# Altium project Nestling_2.1_ExpensionBoard.PrjPCB
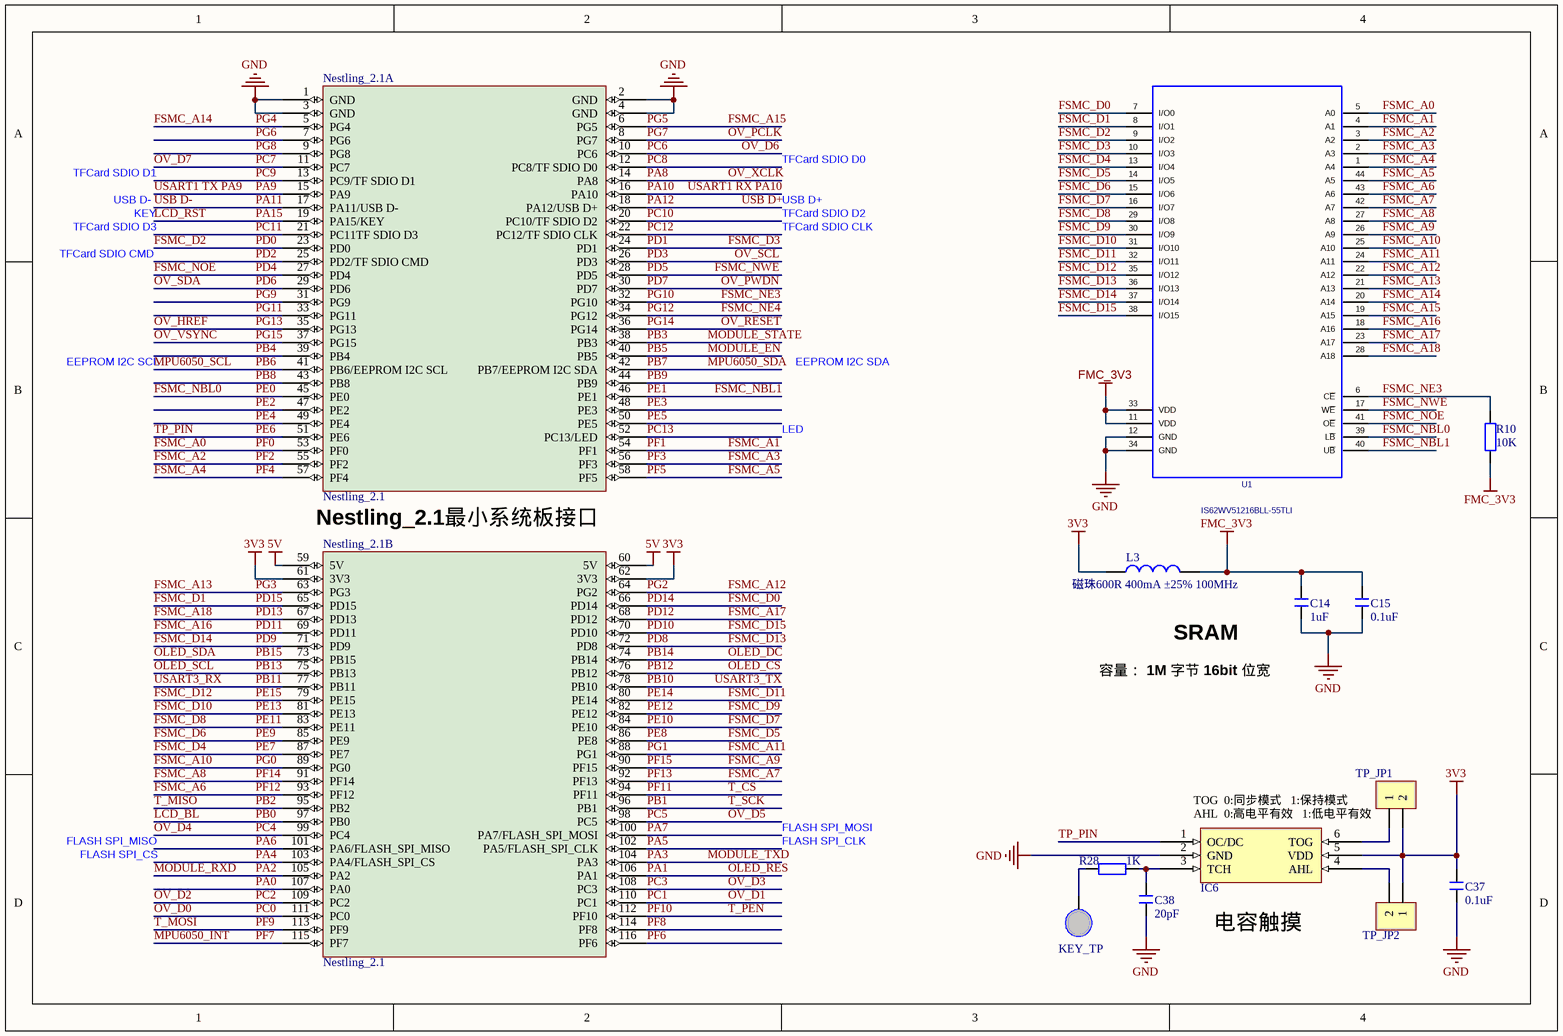
[diagram p0: Nestling_2.1_EXB.SchDoc]
7 sheets, 103 parts. Net scope: global (net labels, ports and power ports of the same name join across sheets).
Board file: Nestling_2.x_EXB.PcbDoc
Sheets:
  Nestling_2.1_EXB.SchDoc
  Nestling_2.1_EXB_POWER.SchDoc
  Nestling_2.1_EXB_Interface.SchDoc
  Nestling_2.1_EXB_MPU6050.SchDoc
  Nestling_2.1_EXB_OLED.SchDoc
  Nestling_2.1_EXB_WIFI_ESP8266EX.SchDoc
  Nestling_2.1_EXB_IO.SchDoc

## Sheet Nestling_2.1_EXB.SchDoc
size A4

### Parts
C14  1uF  [C 0603_M]
C15  0.1uF  [C 0603_M]
C37  0.1uF  [C 0603_M]
C38  20pF  [C 0603_M]
IC6  RH6015C SOT23-6  [SOT23-6N]  (value not drawn)
KEY_TP  TP_Pin  [TP_PIN_10*13mm]  (value not drawn)
L3  磁珠600R 400mA ±25% 100MHz  [L 0603]
Nestling_2.1  Nestling_2.1  [Nestling_2.1]  (parts A,B of 2)
R10  10K  [R 0603_M]
R28  1K  [R 0603_M]
TP_JP1  HDR-1X2  [HDR2.54-LI-2P]  (value not drawn)
TP_JP2  HDR-1X2  [HDR2.54-LI-2P]  (value not drawn)
U1  IS62WV51216BLL-55TLI  [TSOP44-0.8MM]

### Nets
3V3: C37.2 IC6.5(VDD) L3.1 Nestling_2.1.61(3V3) Nestling_2.1.62(3V3) TP_JP1.2 TP_JP2.1
5V: Nestling_2.1.59(5V) Nestling_2.1.60(5V)
FMC_3V3: C14.2 C15.2 L3.2 R10.2 U1.11(VDD) U1.33(VDD)
GND: C14.1 C15.1 C37.1 C38.1 IC6.2(GND) Nestling_2.1.1(GND) Nestling_2.1.2(GND) Nestling_2.1.3(GND) Nestling_2.1.4(GND) U1.12(GND) U1.34(GND)
FSMC_A0: Nestling_2.1.53(PF0) U1.5(A0)  [also labelled PF0]
FSMC_A1: Nestling_2.1.54(PF1) U1.4(A1)  [also labelled PF1]
FSMC_A2: Nestling_2.1.55(PF2) U1.3(A2)  [also labelled PF2]
FSMC_A3: Nestling_2.1.56(PF3) U1.2(A3)  [also labelled PF3]
FSMC_A4: Nestling_2.1.57(PF4) U1.1(A4)  [also labelled PF4]
FSMC_A5: Nestling_2.1.58(PF5) U1.44(A5)  [also labelled PF5]
FSMC_A6: Nestling_2.1.93(PF12) U1.43(A6)  [also labelled PF12]
FSMC_A7: Nestling_2.1.92(PF13) U1.42(A7)  [also labelled PF13]
FSMC_A8: Nestling_2.1.91(PF14) U1.27(A8)  [also labelled PF14]
FSMC_A9: Nestling_2.1.90(PF15) U1.26(A9)  [also labelled PF15]
FSMC_A10: Nestling_2.1.89(PG0) U1.25(A10)  [also labelled PG0]
FSMC_A11: Nestling_2.1.88(PG1) U1.24(A11)  [also labelled PG1]
FSMC_A12: Nestling_2.1.64(PG2) U1.22(A12)  [also labelled PG2]
FSMC_A13: Nestling_2.1.63(PG3) U1.21(A13)  [also labelled PG3]
FSMC_A14: Nestling_2.1.5(PG4) U1.20(A14)  [also labelled PG4]
FSMC_A15: Nestling_2.1.6(PG5) U1.19(A15)  [also labelled PG5]
FSMC_A16: Nestling_2.1.69(PD11) U1.18(A16)  [also labelled PD11]
FSMC_A17: Nestling_2.1.68(PD12) U1.23(A17)  [also labelled PD12]
FSMC_A18: Nestling_2.1.67(PD13) U1.28(A18)  [also labelled PD13]
FSMC_D0: Nestling_2.1.66(PD14) U1.7(I/O0)  [also labelled PD14]
FSMC_D1: Nestling_2.1.65(PD15) U1.8(I/O1)  [also labelled PD15]
FSMC_D2: Nestling_2.1.23(PD0) U1.9(I/O2)  [also labelled PD0]
FSMC_D3: Nestling_2.1.24(PD1) U1.10(I/O3)  [also labelled PD1]
FSMC_D4: Nestling_2.1.87(PE7) U1.13(I/O4)  [also labelled PE7]
FSMC_D5: Nestling_2.1.86(PE8) U1.14(I/O5)  [also labelled PE8]
FSMC_D6: Nestling_2.1.85(PE9) U1.15(I/O6)  [also labelled PE9]
FSMC_D7: Nestling_2.1.84(PE10) U1.16(I/O7)  [also labelled PE10]
FSMC_D8: Nestling_2.1.83(PE11) U1.29(I/O8)  [also labelled PE11]
FSMC_D9: Nestling_2.1.82(PE12) U1.30(I/O9)  [also labelled PE12]
FSMC_D10: Nestling_2.1.81(PE13) U1.31(I/O10)  [also labelled PE13]
FSMC_D11: Nestling_2.1.80(PE14) U1.32(I/O11)  [also labelled PE14]
FSMC_D12: Nestling_2.1.79(PE15) U1.35(I/O12)  [also labelled PE15]
FSMC_D13: Nestling_2.1.72(PD8) U1.36(I/O13)  [also labelled PD8]
FSMC_D14: Nestling_2.1.71(PD9) U1.37(I/O14)  [also labelled PD9]
FSMC_D15: Nestling_2.1.70(PD10) U1.38(I/O15)  [also labelled PD10]
FSMC_NBL0: Nestling_2.1.45(PE0) U1.39(L~{B})  [also labelled PE0]
FSMC_NBL1: Nestling_2.1.46(PE1) U1.40(U~{B})  [also labelled PE1]
FSMC_NE3: Nestling_2.1.32(PG10) R10.1 U1.6(C~{E})  [also labelled PG10]
FSMC_NE4: Nestling_2.1.34(PG12)  [also labelled PG12]
FSMC_NOE: Nestling_2.1.27(PD4) U1.41(O~{E})  [also labelled PD4]
FSMC_NWE: Nestling_2.1.28(PD5) U1.17(W~{E})  [also labelled PD5]
LCD_BL: Nestling_2.1.97(PB0)  [also labelled PB0]
LCD_RST: Nestling_2.1.19(PA15/KEY)  [also labelled PA15]
MODULE_EN: Nestling_2.1.40(PB5)  [also labelled PB5]
MODULE_RXD: Nestling_2.1.105(PA2)  [also labelled PA2]
MODULE_STATE: Nestling_2.1.38(PB3)  [also labelled PB3]
MODULE_TXD: Nestling_2.1.104(PA3)  [also labelled PA3]
MPU6050_INT: Nestling_2.1.115(PF7)  [also labelled PF7]
MPU6050_SCL: Nestling_2.1.41(PB6/EEPROM_I2C_SCL)  [also labelled PB6]
MPU6050_SDA: Nestling_2.1.42(PB7/EEPROM_I2C_SDA)  [also labelled PB7]
OLED_CS: Nestling_2.1.76(PB12)  [also labelled PB12]
OLED_DC: Nestling_2.1.74(PB14)  [also labelled PB14]
OLED_RES: Nestling_2.1.106(PA1)  [also labelled PA1]
OLED_SCL: Nestling_2.1.75(PB13)  [also labelled PB13]
OLED_SDA: Nestling_2.1.73(PB15)  [also labelled PB15]
OV_D0: Nestling_2.1.111(PC0)  [also labelled PC0]
OV_D1: Nestling_2.1.110(PC1)  [also labelled PC1]
OV_D2: Nestling_2.1.109(PC2)  [also labelled PC2]
OV_D3: Nestling_2.1.108(PC3)  [also labelled PC3]
OV_D4: Nestling_2.1.99(PC4)  [also labelled PC4]
OV_D5: Nestling_2.1.98(PC5)  [also labelled PC5]
OV_D6: Nestling_2.1.10(PC6)  [also labelled PC6]
OV_D7: Nestling_2.1.11(PC7)  [also labelled PC7]
OV_HREF: Nestling_2.1.35(PG13)  [also labelled PG13]
OV_PCLK: Nestling_2.1.8(PG7)  [also labelled PG7]
OV_PWDN: Nestling_2.1.30(PD7)  [also labelled PD7]
OV_RESET: Nestling_2.1.36(PG14)  [also labelled PG14]
OV_SCL: Nestling_2.1.26(PD3)  [also labelled PD3]
OV_SDA: Nestling_2.1.29(PD6)  [also labelled PD6]
OV_VSYNC: Nestling_2.1.37(PG15)  [also labelled PG15]
OV_XCLK: Nestling_2.1.14(PA8)  [also labelled PA8]
PA0: Nestling_2.1.107(PA0)
PA4: Nestling_2.1.103(PA4/FLASH_SPI_CS)
PA5: Nestling_2.1.102(PA5/FLASH_SPI_CLK)
PA6: Nestling_2.1.101(PA6/FLASH_SPI_MISO)
PA7: Nestling_2.1.100(PA7/FLASH_SPI_MOSI)
PA9: Nestling_2.1.15(PA9)  [also labelled USART1 TX PA9]
PA10: Nestling_2.1.16(PA10)  [also labelled USART1 RX PA10]
PA11: Nestling_2.1.17(PA11/USB_D-)  [also labelled USB D-]
PA12: Nestling_2.1.18(PA12/USB_D+)  [also labelled USB D+]
PB1: Nestling_2.1.96(PB1)  [also labelled T_SCK]
PB2: Nestling_2.1.95(PB2)  [also labelled T_MISO]
PB4: Nestling_2.1.39(PB4)
PB8: Nestling_2.1.43(PB8)
PB9: Nestling_2.1.44(PB9)
PB10: Nestling_2.1.78(PB10)  [also labelled USART3_TX]
PB11: Nestling_2.1.77(PB11)  [also labelled USART3_RX]
PC8: Nestling_2.1.12(PC8/TF_SDIO_D0)
PC9: Nestling_2.1.13(PC9/TF_SDIO_D1)
PC10: Nestling_2.1.20(PC10/TF_SDIO_D2)
PC11: Nestling_2.1.21(PC11TF_SDIO_D3)
PC12: Nestling_2.1.22(PC12/TF_SDIO_CLK)
PC13: Nestling_2.1.52(PC13/LED)
PD2: Nestling_2.1.25(PD2/TF_SDIO_CMD)
PE2: Nestling_2.1.47(PE2)
PE3: Nestling_2.1.48(PE3)
PE4: Nestling_2.1.49(PE4)
PE5: Nestling_2.1.50(PE5)
PE6: IC6.1(OC/DC) Nestling_2.1.51(PE6)  [also labelled TP_PIN]
PF6: Nestling_2.1.116(PF6)
PF8: Nestling_2.1.114(PF8)
PF9: Nestling_2.1.113(PF9)  [also labelled T_MOSI]
PF10: Nestling_2.1.112(PF10)  [also labelled T_PEN]
PF11: Nestling_2.1.94(PF11)  [also labelled T_CS]
PG6: Nestling_2.1.7(PG6)
PG8: Nestling_2.1.9(PG8)
PG9: Nestling_2.1.31(PG9)
PG11: Nestling_2.1.33(PG11)
NetC38_2: C38.2 IC6.3(TCH) R28.1
NetIC6_4: IC6.4(AHL) TP_JP2.2
NetIC6_6: IC6.6(TOG) TP_JP1.1
NetKEY_TP_1: KEY_TP.1 R28.2

### Notes on the sheet
- TFCard SDIO D1
- TFCard SDIO D0
- TFCard SDIO D3
- USB D-
- KEY
- TFCard SDIO CLK
- TFCard SDIO D2
- USB D+
- TFCard SDIO CMD
- EEPROM I2C SCL
- EEPROM I2C SDA
- LED
- (near Nestling_2.1) Nestling_2.1最小系统板接口
- (near L3) SRAM
- 容量： 1M 字节 16bit 位宽
- FLASH SPI_MISO
- FLASH SPI_CLK
- FLASH SPI_MOSI
- (near IC6) TOG  0:同步模式   1:保持模式
- (near IC6) AHL  0:高电平有效   1:低电平有效
- FLASH SPI_CS
- 电容触摸

### Library data of the parts
C14 C15 C37 C38 = C: 无极性贴片电容; 版权归属: 源创客; BOM名称: 无极性贴片电容; 学习资源: www.ooocke.com
IC6 = RH6015C: 贴片单通道电容式触摸感应控制开关IC
L3 = L: 小功率贴片电感; 版权归属: 源创客; BOM名称: 小功率贴片电感; 学习资源: www.ooocke.com
R10 R28 = RES: Resistor
TP_JP1 TP_JP2 = Header 2: 2P接插件; 版权归属: 源创客; BOM名称: 2P接插件; 学习资源: www.ooocke.com
U1 = IS62WV51216BLL-55TLI: TSOP-II,2.5V - 3.6V, 512K x 16,55ns; Manufacturer #1 PN: IS62WV51216BLL-55TI; Manufacturer #1: ISSI; Value: IS62WV51216BLL-55TI; Tolerance: 55ns; PCB DECAL: TSOP44-0.8MM

## Sheet Nestling_2.1_EXB_POWER.SchDoc
size A4
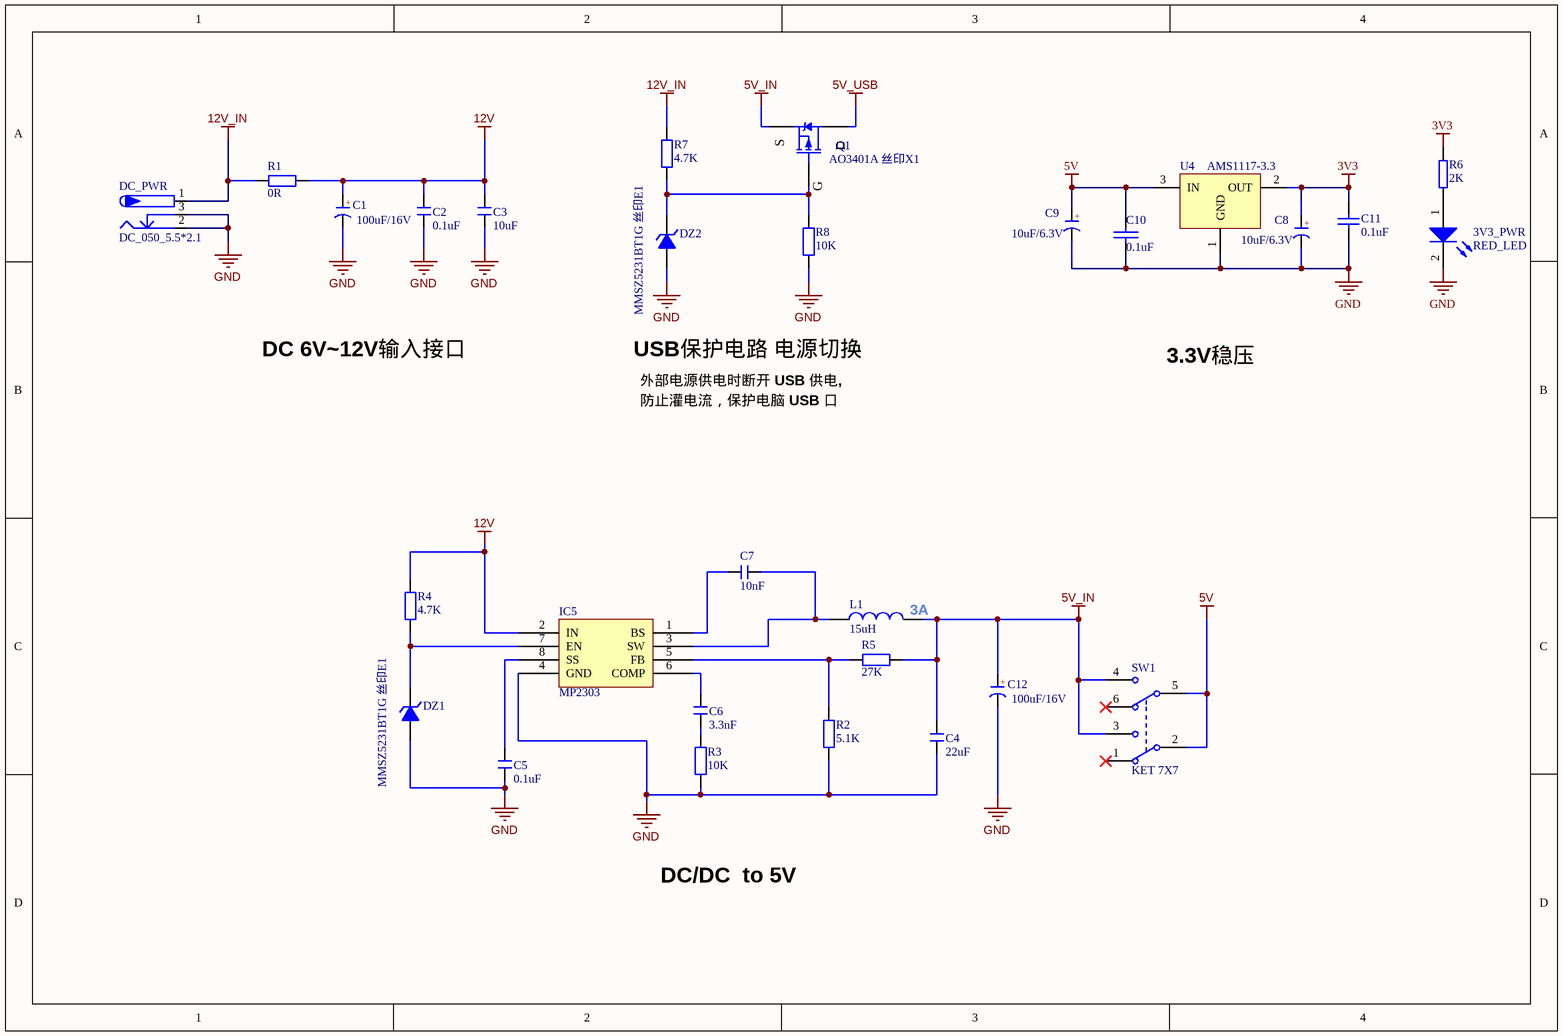
[diagram p1: Nestling_2.1_EXB_POWER.SchDoc]

### Parts
3V3_PWR  RED_LED  [LED 0603R]
C1  100uF/16V  [CM D(6.3*5.4)]
C2  0.1uF  [C 0603_M]
C3  10uF  [C 0603_M]
C4  22uF  [C 0603_M]
C5  0.1uF  [C 0603_M]
C6  3.3nF  [C 0603_M]
C7  10nF  [C 0603_M]
C8  10uF/6.3V  [CD S(2012)]
C9  10uF/6.3V  [CD S(2012)]
C10  0.1uF  [C 0603_M]
C11  0.1uF  [C 0603_M]
C12  100uF/16V  [CM D(6.3*5.4)]
DC_PWR  DC_050_5.5*2.1  [DC-050]
DZ1  MMSZ5231BT1G 丝印E1  [SOD-123]
DZ2  MMSZ5231BT1G 丝印E1  [SOD-123]
IC5  MP2303  [SOP8_N]
L1  15uH  [L-SMD-0630]
Q1  AO3401A 丝印X1  [SOT23-3N]
R1  0R  [R 0603_M]
R2  5.1K  [R 0603_M]
R3  10K  [R 0603_M]
R4  4.7K  [R 0603_M]
R5  27K  [R 0603_M]
R6  2K  [R 0603_M]
R7  4.7K  [R 0603_M]
R8  10K  [R 0603_M]
SW1  KET 7X7  [KFT DIP-7X7]
U4  AMS1117-3.3  [SOT223_N]

### Nets
3V3: C8.1(A) C11.1 R6.2 U4.2(OUT)
5V: C9.1(A) C10.1 SW1.2(COM2) SW1.5(COM2) U4.3(IN)
5V_IN: C4.2 C12.1(A) L1.2 Q1.2(S) R5.1 SW1.3(NO1) SW1.4(NO2)
5V_USB: Q1.3(D)
12V: C1.1(A) C2.2 C3.2 IC5.2(IN) R1.2 R4.2
12V_IN: DC_PWR.1 R1.1 R7.2
GND: 3V3_PWR.2(K) C1.2(K) C2.1 C3.1 C4.1 C5.1 C8.2(K) C9.2(K) C10.2 C11.2 C12.2(K) DC_PWR.2 DC_PWR.3 DZ1.1(A) DZ2.1(A) IC5.4(GND) R2.1 R3.1 R8.1 U4.1(GND)
Net3V3_PWR_1: 3V3_PWR.1(A) R6.1
NetC5_2: C5.2 IC5.8(SS)
NetC6_1: C6.1 R3.2
NetC6_2: C6.2 IC5.6(COMP)
NetC7_1: C7.1 IC5.3(SW) L1.1
NetC7_2: C7.2 IC5.1(BS)
NetDZ1_2: DZ1.2(K) IC5.7(EN) R4.1
NetDZ2_2: DZ2.2(K) Q1.1(G) R7.1 R8.2
NetIC5_5: IC5.5(FB) R2.2 R5.2

Not connected (* = marked no-connect by the designer): SW1 1(NC1)* 6(NC2)*

### Notes on the sheet
- DC 6V~12V输入接口
- USB保护电路 电源切换
- 外部电源供电时断开 USB 供电,
- 3.3V稳压
- 防止灌电流，保护电脑 USB 口
- (near L1) 3A
- DC/DC  to 5V
- (in symbol C-CD) +
- (in symbol C-CM) +

### Library data of the parts
3V3_PWR = LED0: Typical INFRARED GaAs LED
C1 C12 = C-CM: 贴片电解电容; 版权归属: 源创客; BOM名称: 贴片电解电容; 学习资源: www.ooocke.com
C2-C7 = C: 无极性贴片电容; 版权归属: 源创客; BOM名称: 无极性贴片电容; 学习资源: www.ooocke.com
C8 C9 = C-CD: 贴片钽电容; 版权归属: 源创客; BOM名称: 贴片钽电容; 学习资源: www.ooocke.com
C10 = CAP: Capacitor
C11 = Cap: Capacitor; Published: 8-Jun-2000; LatestRevisionDate: 17-Jul-2002; LatestRevisionNote: Re-released for DXP Platform.; PackageReference: RAD-0.3; Publisher: Altium Limited
DC_PWR = P-DC: 低压电源接口; BOM名称: DC电源接口; 版权归属: 源创客; 学习资源: www.ooocke.com
DZ1 DZ2 = 1N4625: 5.1V/0.5W稳压管; 版权归属: 源创客; BOM名称: 5.1V/0.5W稳压管; 学习资源: www.ooocke.com
L1 = L: 小功率贴片电感; 版权归属: 源创客; BOM名称: 小功率贴片电感; 学习资源: www.ooocke.com
Q1 = SI2301: P沟道场效应管; 版权归属: 源创客; BOM名称: P沟道场效应管; 学习资源: www.ooocke.com
R1-R5 R7 R8 = R: 贴片电阻; 版权归属: 源创客; BOM名称: 贴片电阻; 学习资源: www.ooocke.com
R6 = R
SW1 = KET 7X7: 7*7自锁开关; 版权归属: 源创客; BOM名称: 7*7自锁开关; 学习资源: www.ooocke.com
U4 = LT1085CM-3.3

## Sheet Nestling_2.1_EXB_Interface.SchDoc
size A4
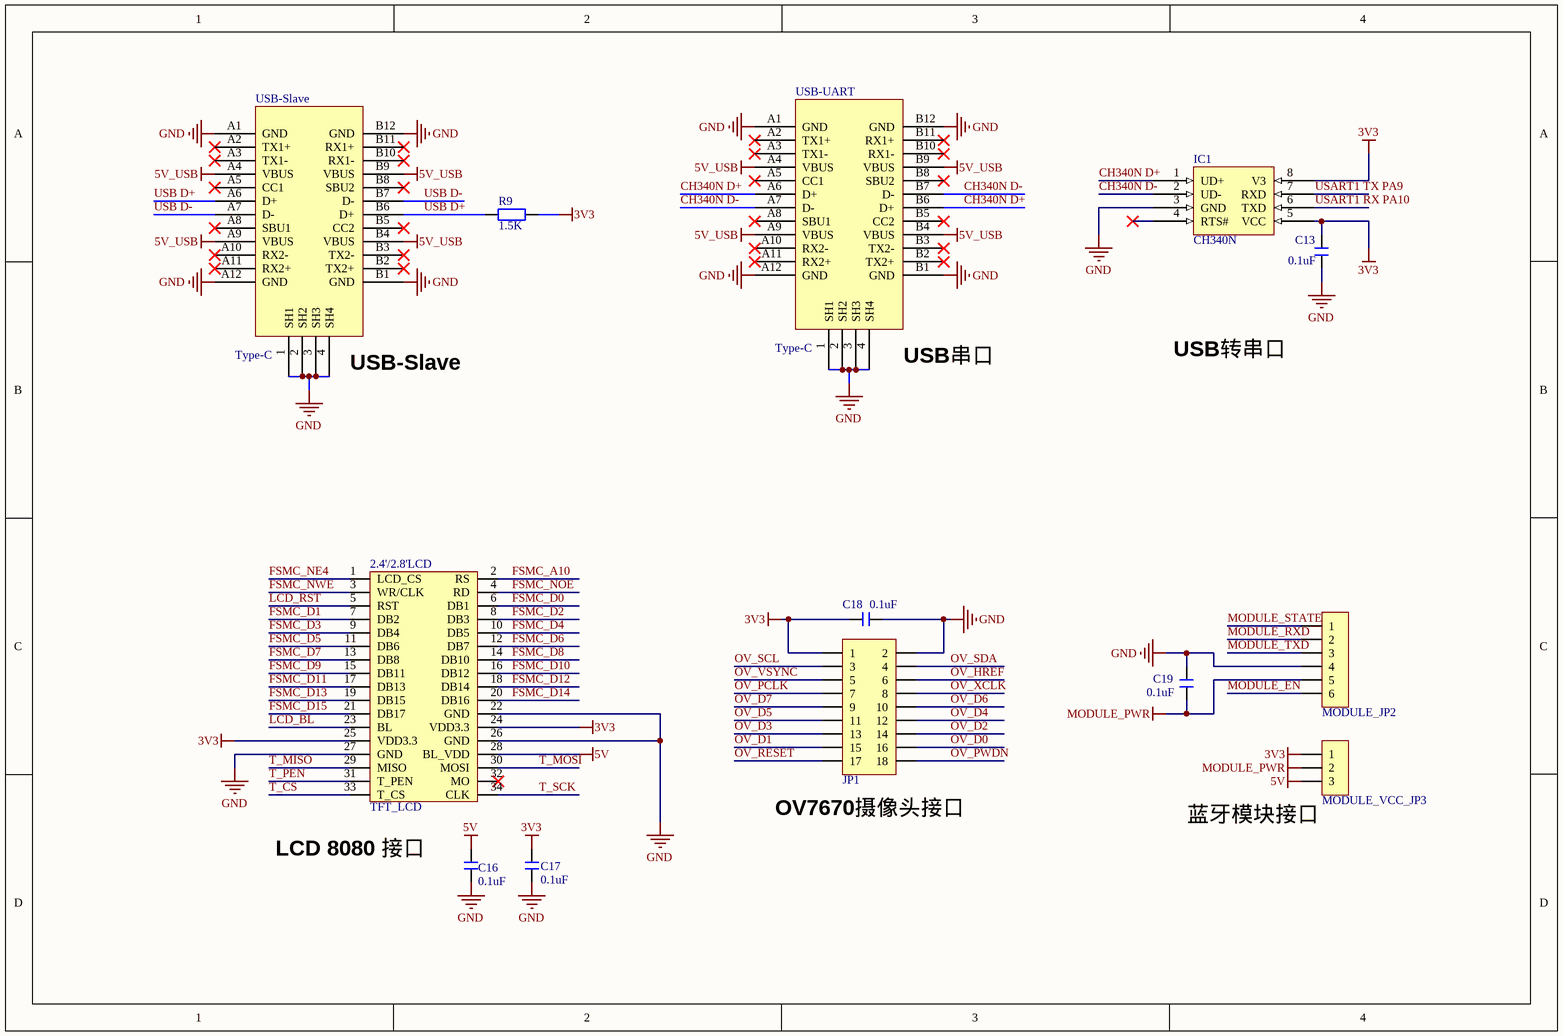
[diagram p2: Nestling_2.1_EXB_Interface.SchDoc]

### Parts
2.4'/2.8'LCD  TFT_LCD  [db2*17-4.3]
C13  0.1uF  [C 0603_M]
C16  0.1uF  [C 0603_M]
C17  0.1uF  [C 0603_M]
C18  0.1uF  [C 0603_M]
C19  0.1uF  [C 0603_M]
IC1  CH340N  [SOP8_N]
JP1  Header 9X2  [HDR2.54-LI-2x9P]  (value not drawn)
MODULE_JP2  HDR-1X6  [HDR2.54-M-LI-6P]  (value not drawn)
MODULE_VCC_JP3  HDR-1X3  [HDR2.54-LI-3P]  (value not drawn)
R9  1.5K  [R 0603_M]
USB-Slave  Type-C  [Type-C]
USB-UART  Type-C  [Type-C]

### Nets
3V3: 2.4'/2.8'LCD.24(VDD3.3) 2.4'/2.8'LCD.25(VDD3.3) C13.2 C17.1 C18.1 IC1.5(VCC) IC1.8(V3) JP1.1 MODULE_VCC_JP3.1 R9.1
5V: 2.4'/2.8'LCD.28(BL_VDD) C16.2 MODULE_VCC_JP3.3
5V_USB: USB-Slave.A4(VBUS) USB-Slave.A9(VBUS) USB-Slave.B4(VBUS) USB-Slave.B9(VBUS) USB-UART.A4(VBUS) USB-UART.A9(VBUS) USB-UART.B4(VBUS) USB-UART.B9(VBUS)
GND: 2.4'/2.8'LCD.22(GND) 2.4'/2.8'LCD.26(GND) 2.4'/2.8'LCD.27(GND) C13.1 C16.1 C17.2 C18.2 C19.2 IC1.3(GND) JP1.2 MODULE_JP2.4 USB-Slave.1(SH1) USB-Slave.2(SH2) USB-Slave.3(SH3) USB-Slave.4(SH4) USB-Slave.A1(GND) USB-Slave.A12(GND) USB-Slave.B1(GND) USB-Slave.B12(GND) USB-UART.1(SH1) USB-UART.2(SH2) USB-UART.3(SH3) USB-UART.4(SH4) USB-UART.A1(GND) USB-UART.A12(GND) USB-UART.B1(GND) USB-UART.B12(GND)
MODULE_PWR: C19.1 MODULE_JP2.5 MODULE_VCC_JP3.2
CH340N D+: IC1.1(UD+) USB-UART.A6(D+) USB-UART.B6(D+)
CH340N D-: IC1.2(UD-) USB-UART.A7(D-) USB-UART.B7(D-)
FSMC_A10: 2.4'/2.8'LCD.2(RS)
FSMC_D0: 2.4'/2.8'LCD.6(DB1)
FSMC_D1: 2.4'/2.8'LCD.7(DB2)
FSMC_D2: 2.4'/2.8'LCD.8(DB3)
FSMC_D3: 2.4'/2.8'LCD.9(DB4)
FSMC_D4: 2.4'/2.8'LCD.10(DB5)
FSMC_D5: 2.4'/2.8'LCD.11(DB6)
FSMC_D6: 2.4'/2.8'LCD.12(DB7)
FSMC_D7: 2.4'/2.8'LCD.13(DB8)
FSMC_D8: 2.4'/2.8'LCD.14(DB10)
FSMC_D9: 2.4'/2.8'LCD.15(DB11)
FSMC_D10: 2.4'/2.8'LCD.16(DB12)
FSMC_D11: 2.4'/2.8'LCD.17(DB13)
FSMC_D12: 2.4'/2.8'LCD.18(DB14)
FSMC_D13: 2.4'/2.8'LCD.19(DB15)
FSMC_D14: 2.4'/2.8'LCD.20(DB16)
FSMC_D15: 2.4'/2.8'LCD.21(DB17)
FSMC_NE4: 2.4'/2.8'LCD.1(LCD_CS)
FSMC_NOE: 2.4'/2.8'LCD.4(RD)
FSMC_NWE: 2.4'/2.8'LCD.3(WR/CLK)
LCD_BL: 2.4'/2.8'LCD.23(BL)
LCD_RST: 2.4'/2.8'LCD.5(RST)
MODULE_EN: MODULE_JP2.6
MODULE_RXD: MODULE_JP2.2
MODULE_STATE: MODULE_JP2.1
MODULE_TXD: MODULE_JP2.3
OV_D0: JP1.16
OV_D1: JP1.15
OV_D2: JP1.14
OV_D3: JP1.13
OV_D4: JP1.12
OV_D5: JP1.11
OV_D6: JP1.10
OV_D7: JP1.9
OV_HREF: JP1.6
OV_PCLK: JP1.7
OV_PWDN: JP1.18
OV_RESET: JP1.17
OV_SCL: JP1.3
OV_SDA: JP1.4
OV_VSYNC: JP1.5
OV_XCLK: JP1.8
T_CS: 2.4'/2.8'LCD.33(T_CS)  [project net PF11]
T_MISO: 2.4'/2.8'LCD.29(MISO)  [project net PB2]
T_MOSI: 2.4'/2.8'LCD.30(MOSI)  [project net PF9]
T_PEN: 2.4'/2.8'LCD.31(T_PEN)  [project net PF10]
T_SCK: 2.4'/2.8'LCD.34(CLK)  [project net PB1]
USART1 RX PA10: IC1.6(TXD)  [project net PA10]
USART1 TX PA9: IC1.7(RXD)  [project net PA9]
USB D+: R9.2 USB-Slave.A6(D+) USB-Slave.B6(D+)  [project net PA12]
USB D-: USB-Slave.A7(D-) USB-Slave.B7(D-)  [project net PA11]

Not connected (* = marked no-connect by the designer): 2.4'/2.8'LCD 32(MO)*; IC1 4(RTS#)*; USB-Slave A2(TX1+)* A3(TX1-)* A5(CC1)* A8(SBU1)* A10(RX2-)* A11(RX2+)* B2(TX2+)* B3(TX2-)* B5(CC2)* B8(SBU2)* B10(RX1-)* B11(RX1+)*; USB-UART A2(TX1+)* A3(TX1-)* A5(CC1)* A8(SBU1)* A10(RX2-)* A11(RX2+)* B2(TX2+)* B3(TX2-)* B5(CC2)* B8(SBU2)* B10(RX1-)* B11(RX1+)*

### Notes on the sheet
- (near USB-Slave) USB-Slave
- (near USB-UART) USB串口
- USB转串口
- (near JP1) OV7670摄像头接口
- 蓝牙模块接口
- (near 2.4'/2.8'LCD) LCD 8080 接口

### Library data of the parts
C13 C16-C19 = C: 无极性贴片电容; 版权归属: 源创客; BOM名称: 无极性贴片电容; 学习资源: www.ooocke.com
IC1 = CH340N: USB 转串口芯片 CH330/CH340N
JP1 = Header 9X2: 9*2P接插件; 版权归属: 源创客; BOM名称: 9*2P接插件; 学习资源: www.ooocke.com
MODULE_JP2 = Header 6: 6P接插件; 版权归属: 源创客; BOM名称: 6P接插件; 学习资源: www.ooocke.com
MODULE_VCC_JP3 = Header 3: 3P接插件; 版权归属: 源创客; BOM名称: 3P接插件; 学习资源: www.ooocke.com
R9 = RES: Resistor

## Sheet Nestling_2.1_EXB_MPU6050.SchDoc
size A4
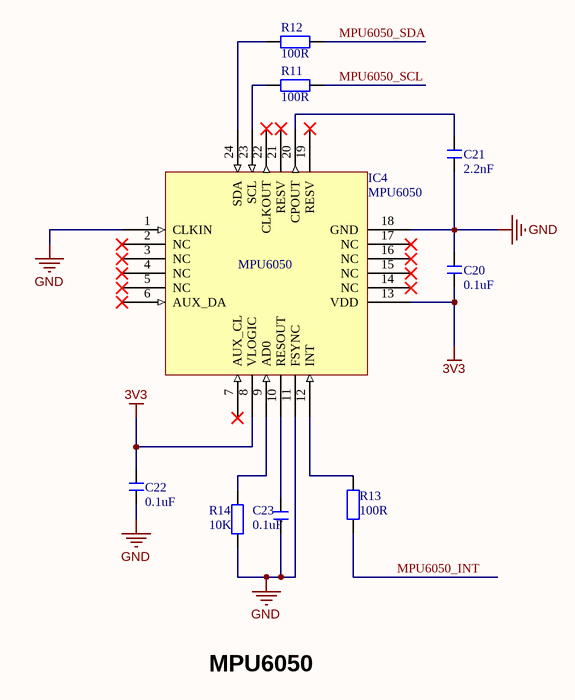
[diagram p3: Nestling_2.1_EXB_MPU6050.SchDoc]

### Parts
C20  0.1uF  [C 0603_M]
C21  2.2nF  [C 0603_M]
C22  0.1uF  [C 0603_M]
C23  0.1uF  [C 0603_M]
IC4  MPU6050  [QFN24 4x4_N]
R11  100R  [R 0603_M]
R12  100R  [R 0603_M]
R13  100R  [R 0603_M]
R14  10K  [R 0603_M]

### Nets
3V3: C20.2 C22.1 IC4.8(VLOGIC) IC4.13(VDD)
GND: C20.1 C21.2 C22.2 C23.2 IC4.1(CLKIN) IC4.11(FSYNC) IC4.18(GND) R14.2
MPU6050_INT: R13.1
MPU6050_SCL: R11.1
MPU6050_SDA: R12.1
NetC21_1: C21.1 IC4.20(CPOUT)
NetC23_1: C23.1 IC4.10(RESOUT)
NetIC4_9: IC4.9(AD0) R14.1
NetIC4_12: IC4.12(INT) R13.2
NetIC4_23: IC4.23(SCL) R11.2
NetIC4_24: IC4.24(SDA) R12.2

Not connected (* = marked no-connect by the designer): IC4 2(NC)* 3(NC)* 4(NC)* 5(NC)* 6(AUX_DA)* 7(AUX_CL)* 14(NC)* 15(NC)* 16(NC)* 17(NC)* 19(RESV)* 21(RESV)* 22(CLKOUT)*

### Notes on the sheet
- MPU6050

### Library data of the parts
C20-C23 = C: 无极性贴片电容; 版权归属: 源创客; BOM名称: 无极性贴片电容; 学习资源: www.ooocke.com
R11-R14 = RES: Resistor

## Sheet Nestling_2.1_EXB_OLED.SchDoc
size A4
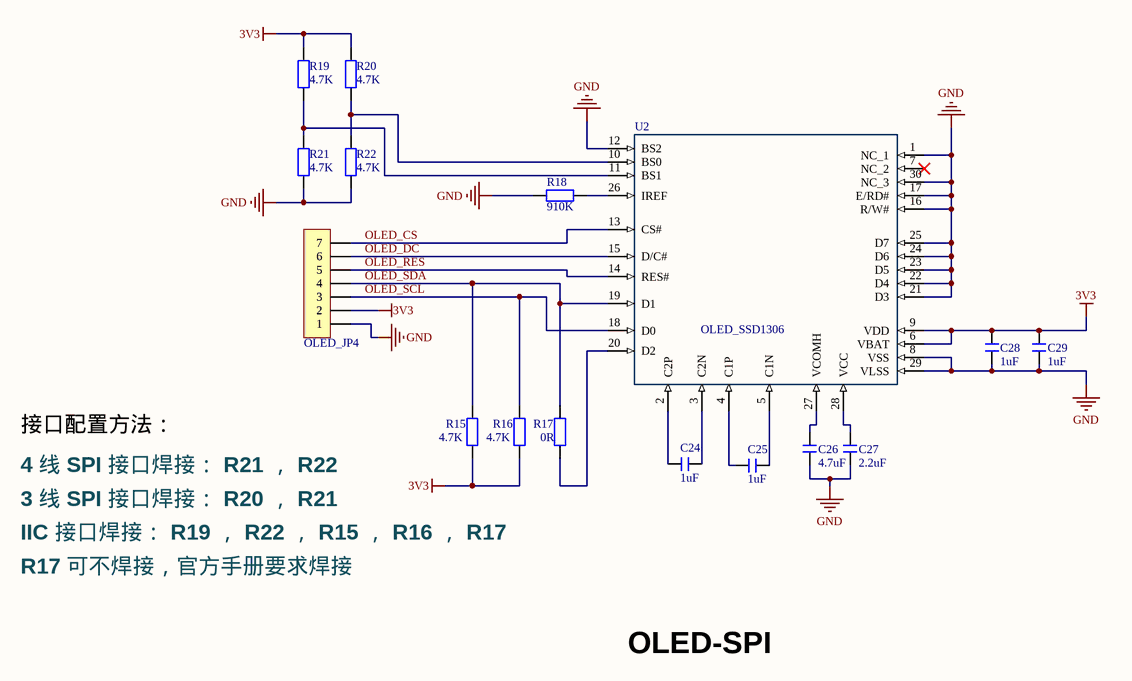
[diagram p4: Nestling_2.1_EXB_OLED.SchDoc]

### Parts
C24  1uF  [C 0603_M]
C25  1uF  [C 0603_M]
C26  4.7uF  [C 0603_M]
C27  2.2uF  [C 0603_M]
C28  1uF  [C 0603_M]
C29  1uF  [C 0603_M]
OLED_JP4  HDR-1X7  [HDR2.54-M-LI-7P]  (value not drawn)
R15  4.7K  [R 0603_M]
R16  4.7K  [R 0603_M]
R17  0R  [R 0603_M]
R18  910K  [R 0603_M]
R19  4.7K  [R 0603_M]
R20  4.7K  [R 0603_M]
R21  4.7K  [R 0603_M]
R22  4.7K  [R 0603_M]
U2  OLED_SSD1306  [30P_0.7mm]

### Nets
3V3: C28.1 C29.1 OLED_JP4.2 R15.2 R16.2 R19.2 R20.2 U2.6(VBAT) U2.9(VDD)
GND: C26.2 C27.2 C28.2 C29.2 OLED_JP4.1 R18.1 R21.1 R22.1 U2.1(NC_1) U2.8(VSS) U2.12(BS2) U2.16(R/W#) U2.17(E/RD#) U2.21(D3) U2.22(D4) U2.23(D5) U2.24(D6) U2.25(D7) U2.29(VLSS) U2.30(NC_3)
OLED_CS: OLED_JP4.7 U2.13(CS#)
OLED_DC: OLED_JP4.6 U2.15(D/C#)
OLED_RES: OLED_JP4.5 U2.14(RES#)
OLED_SCL: OLED_JP4.3 R16.1 U2.18(D0)
OLED_SDA: OLED_JP4.4 R15.1 R17.1 U2.19(D1)
NetC24_1: C24.1 U2.2(C2P)
NetC24_2: C24.2 U2.3(C2N)
NetC25_1: C25.1 U2.4(C1P)
NetC25_2: C25.2 U2.5(C1N)
NetC26_1: C26.1 U2.27(VCOMH)
NetC27_1: C27.1 U2.28(VCC)
NetR17_2: R17.2 U2.20(D2)
NetR18_2: R18.2 U2.26(IREF)
NetR19_1: R19.1 R21.2 U2.11(BS1)
NetR20_1: R20.1 R22.2 U2.10(BS0)

Not connected (* = marked no-connect by the designer): U2 7(NC_2)*

### Notes on the sheet
- 接口配置方法：
- 4 线 SPI 接口焊接： R21 ， R22
- 3 线 SPI 接口焊接： R20 ， R21
- IIC 接口焊接： R19 ， R22 ， R15 ， R16 ， R17
- R17 可不焊接，官方手册要求焊接
- OLED-SPI

### Library data of the parts
C24-C29 = C: 无极性贴片电容; 版权归属: 源创客; BOM名称: 无极性贴片电容; 学习资源: www.ooocke.com
OLED_JP4 = Header 7: 7P接插件; 版权归属: 源创客; BOM名称: 7P接插件; 学习资源: www.ooocke.com
R15-R22 = RES: Resistor
U2 = OLED_0.96_SSD1306: OLED_0.96寸_SSD1306，裸屏接口

## Sheet Nestling_2.1_EXB_WIFI_ESP8266EX.SchDoc
size A4
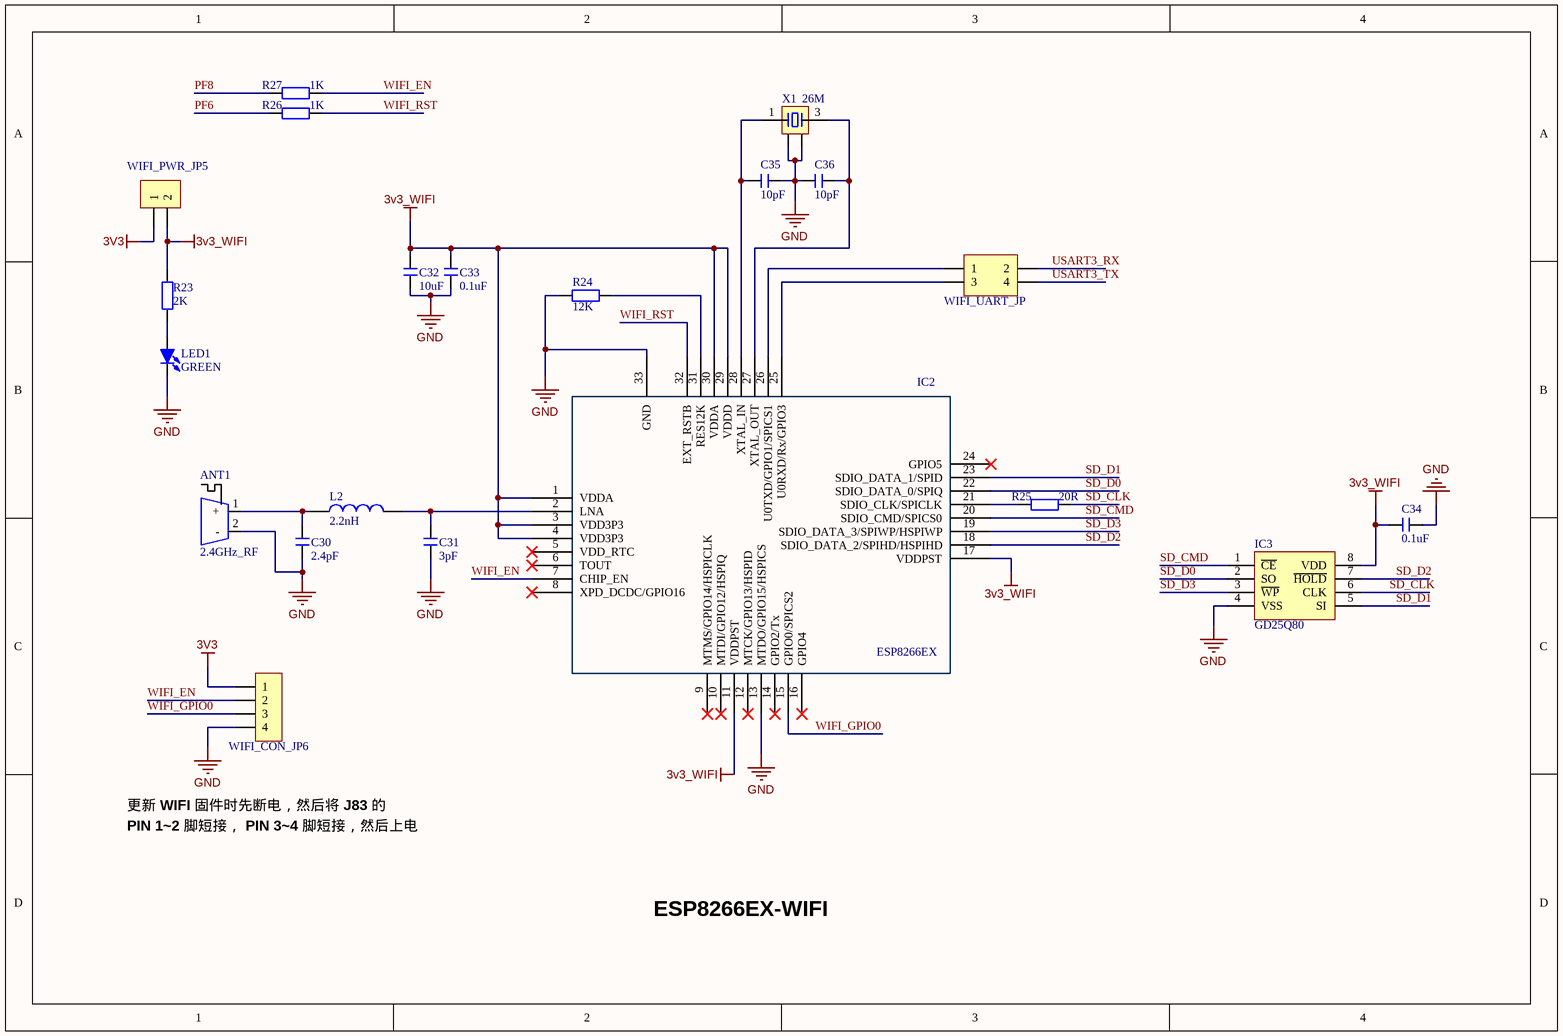
[diagram p5: Nestling_2.1_EXB_WIFI_ESP8266EX.SchDoc]

### Parts
ANT1  2.4GHz_RF  [ANT-F-1-2.4G]
C30  2.4pF  [C 0603_M]
C31  3pF  [C 0603_M]
C32  10uF  [C 0603_M]
C33  0.1uF  [C 0603_M]
C34  0.1uF  [C 0603_M]
C35  10pF  [C 0603_M]
C36  10pF  [C 0603_M]
IC2  ESP8266EX  [QFN32 5x5_L]
IC3  GD25Q80  [SOP8W_N]
L2  2.2nH  [L 0603]
LED1  GREEN  [LED 0603G]
R23  2K  [R 0603_M]
R24  12K  [R 0603_M]
R25  20R  [R 0603_M]
R26  1K  [R 0603_M]
R27  1K  [R 0603_M]
WIFI_CON_JP6  HDR-1X4  [HDR2.54-LI-4P]  (value not drawn)
WIFI_PWR_JP5  HDR-1X2  [HDR2.54-LI-2P]  (value not drawn)
WIFI_UART_JP  Header2X2  [HDR2.54-LI-2x2P]  (value not drawn)
X1  26M  [OSC 3225-4P]

### Nets
3V3: WIFI_CON_JP6.1 WIFI_PWR_JP5.1
3v3_WIFI: C32.1 C33.1 C34.1 IC2.1(VDDA) IC2.3(VDD3P3) IC2.4(VDD3P3) IC2.11(VDDPST) IC2.17(VDDPST) IC2.29(VDDD) IC2.30(VDDA) IC3.8(VDD) R23.2 WIFI_PWR_JP5.2
GND: ANT1.2(-) C30.2 C31.2 C32.2 C33.2 C34.2 C35.1 C36.2 IC2.13(MTDO/GPIO15/HSPICS) IC2.33(GND) IC3.4(VSS) LED1.2(K) R24.2 WIFI_CON_JP6.4 X1.2 X1.4
PF6: R26.2
PF8: R27.2
SD_CLK: IC3.6(CLK) R25.1
SD_CMD: IC2.20(SDIO_CMD/SPICS0) IC3.1(~{CE})
SD_D0: IC2.22(SDIO_DATA_0/SPIQ) IC3.2(SO)
SD_D1: IC2.23(SDIO_DATA_1/SPID) IC3.5(SI)
SD_D2: IC2.18(SDIO_DATA_2/SPIHD/HSPIHD) IC3.7(~{HOLD})
SD_D3: IC2.19(SDIO_DATA_3/SPIWP/HSPIWP) IC3.3(~{WP})
USART3_RX: WIFI_UART_JP.2  [project net PB11]
USART3_TX: WIFI_UART_JP.4  [project net PB10]
WIFI_EN: IC2.7(CHIP_EN) R27.1 WIFI_CON_JP6.2
WIFI_GPIO0: IC2.15(GPIO0/SPICS2) WIFI_CON_JP6.3
WIFI_RST: IC2.32(EXT_RSTB) R26.1
NetANT1_1: ANT1.1(+) C30.1 L2.1
NetC31_1: C31.1 IC2.2(LNA) L2.2
NetC35_2: C35.2 IC2.28(XTAL_IN) X1.1
NetC36_1: C36.1 IC2.27(XTAL_OUT) X1.3
NetIC2_21: IC2.21(SDIO_CLK/SPICLK) R25.2
NetIC2_25: IC2.25(U0RXD/Rx/GPIO3) WIFI_UART_JP.3
NetIC2_26: IC2.26(U0TXD/GPIO1/SPICS1) WIFI_UART_JP.1
NetIC2_31: IC2.31(RES12K) R24.1
NetLED1_1: LED1.1(A) R23.1

Not connected (* = marked no-connect by the designer): IC2 5(VDD_RTC)* 6(TOUT)* 8(XPD_DCDC/GPIO16)* 9(MTMS/GPIO14/HSPICLK)* 10(MTDI/GPIO12/HSPIQ)* 12(MTCK/GPIO13/HSPID)* 14(GPIO2/Tx)* 16(GPIO4)* 24(GPIO5)*

### Notes on the sheet
- 更新 WIFI 固件时先断电，然后将 J83 的
- PIN 1~2 脚短接， PIN 3~4 脚短接，然后上电
- ESP8266EX-WIFI

### Library data of the parts
C30-C36 = C: 无极性贴片电容; 版权归属: 源创客; BOM名称: 无极性贴片电容; 学习资源: www.ooocke.com
IC2 = ESP8266EX: WIFI-芯片; 版权归属: 源创客; BOM名称: WIFI-芯片; 学习资源: www.ooocke.com
IC3 = SST25VFxx: 外置Flash; 版权归属: 源创客; BOM名称: 外置Flash; 学习资源: www.ooocke.com
L2 = L: 小功率贴片电感; 版权归属: 源创客; BOM名称: 小功率贴片电感; 学习资源: www.ooocke.com
LED1 = LED-SMD: 贴片LED; 版权归属: 源创客; BOM名称: 贴片LED; 学习资源: www.ooocke.com
R23-R27 = RES: Resistor
WIFI_CON_JP6 = Header 4: 4P接插件; 版权归属: 源创客; BOM名称: 4P接插件; 学习资源: www.ooocke.com
WIFI_PWR_JP5 = Header 2: 2P接插件; 版权归属: 源创客; BOM名称: 2P接插件; 学习资源: www.ooocke.com
WIFI_UART_JP = Header 2X2: 2*2P接插件; 版权归属: 源创客; BOM名称: 2*2P接插件; 学习资源: www.ooocke.com
X1 = XTAL-4P: 4脚无源晶振; 版权归属: 源创客; BOM名称: 4脚无源晶振; 学习资源: www.ooocke.com

## Sheet Nestling_2.1_EXB_IO.SchDoc
size A4
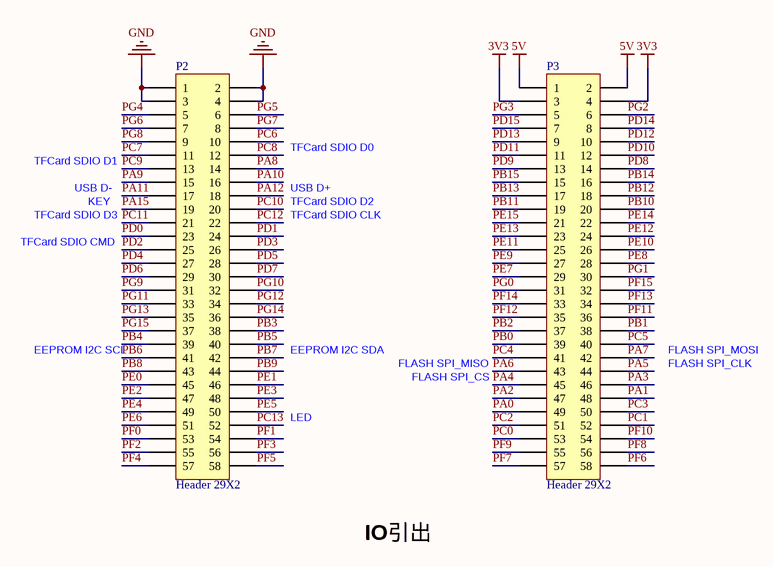
[diagram p6: Nestling_2.1_EXB_IO.SchDoc]

### Parts
P2  Header 29X2  [HDR2X29]
P3  Header 29X2  [HDR2X29]

### Nets
3V3: P3.3 P3.4
5V: P3.1 P3.2
GND: P2.1 P2.2 P2.3 P2.4
PA0: P3.49
PA1: P3.48  [project net OLED_RES]
PA2: P3.47  [project net MODULE_RXD]
PA3: P3.46  [project net MODULE_TXD]
PA4: P3.45
PA5: P3.44
PA6: P3.43
PA7: P3.42
PA8: P2.14  [project net OV_XCLK]
PA9: P2.15
PA10: P2.16
PA11: P2.17
PA12: P2.18
PA15: P2.19  [project net LCD_RST]
PB0: P3.39  [project net LCD_BL]
PB1: P3.38
PB2: P3.37
PB3: P2.38  [project net MODULE_STATE]
PB4: P2.39
PB5: P2.40  [project net MODULE_EN]
PB6: P2.41  [project net MPU6050_SCL]
PB7: P2.42  [project net MPU6050_SDA]
PB8: P2.43
PB9: P2.44
PB10: P3.20
PB11: P3.19
PB12: P3.18  [project net OLED_CS]
PB13: P3.17  [project net OLED_SCL]
PB14: P3.16  [project net OLED_DC]
PB15: P3.15  [project net OLED_SDA]
PC0: P3.53  [project net OV_D0]
PC1: P3.52  [project net OV_D1]
PC2: P3.51  [project net OV_D2]
PC3: P3.50  [project net OV_D3]
PC4: P3.41  [project net OV_D4]
PC5: P3.40  [project net OV_D5]
PC6: P2.10  [project net OV_D6]
PC7: P2.11  [project net OV_D7]
PC8: P2.12
PC9: P2.13
PC10: P2.20
PC11: P2.21
PC12: P2.22
PC13: P2.52
PD0: P2.23  [project net FSMC_D2]
PD1: P2.24  [project net FSMC_D3]
PD2: P2.25
PD3: P2.26  [project net OV_SCL]
PD4: P2.27  [project net FSMC_NOE]
PD5: P2.28  [project net FSMC_NWE]
PD6: P2.29  [project net OV_SDA]
PD7: P2.30  [project net OV_PWDN]
PD8: P3.14  [project net FSMC_D13]
PD9: P3.13  [project net FSMC_D14]
PD10: P3.12  [project net FSMC_D15]
PD11: P3.11  [project net FSMC_A16]
PD12: P3.10  [project net FSMC_A17]
PD13: P3.9  [project net FSMC_A18]
PD14: P3.8  [project net FSMC_D0]
PD15: P3.7  [project net FSMC_D1]
PE0: P2.45  [project net FSMC_NBL0]
PE1: P2.46  [project net FSMC_NBL1]
PE2: P2.47
PE3: P2.48
PE4: P2.49
PE5: P2.50
PE6: P2.51
PE7: P3.29  [project net FSMC_D4]
PE8: P3.28  [project net FSMC_D5]
PE9: P3.27  [project net FSMC_D6]
PE10: P3.26  [project net FSMC_D7]
PE11: P3.25  [project net FSMC_D8]
PE12: P3.24  [project net FSMC_D9]
PE13: P3.23  [project net FSMC_D10]
PE14: P3.22  [project net FSMC_D11]
PE15: P3.21  [project net FSMC_D12]
PF0: P2.53  [project net FSMC_A0]
PF1: P2.54  [project net FSMC_A1]
PF2: P2.55  [project net FSMC_A2]
PF3: P2.56  [project net FSMC_A3]
PF4: P2.57  [project net FSMC_A4]
PF5: P2.58  [project net FSMC_A5]
PF6: P3.58
PF7: P3.57  [project net MPU6050_INT]
PF8: P3.56
PF9: P3.55
PF10: P3.54
PF11: P3.36
PF12: P3.35  [project net FSMC_A6]
PF13: P3.34  [project net FSMC_A7]
PF14: P3.33  [project net FSMC_A8]
PF15: P3.32  [project net FSMC_A9]
PG0: P3.31  [project net FSMC_A10]
PG1: P3.30  [project net FSMC_A11]
PG2: P3.6  [project net FSMC_A12]
PG3: P3.5  [project net FSMC_A13]
PG4: P2.5  [project net FSMC_A14]
PG5: P2.6  [project net FSMC_A15]
PG6: P2.7
PG7: P2.8  [project net OV_PCLK]
PG8: P2.9
PG9: P2.31
PG10: P2.32  [project net FSMC_NE3]
PG11: P2.33
PG12: P2.34  [project net FSMC_NE4]
PG13: P2.35  [project net OV_HREF]
PG14: P2.36  [project net OV_RESET]
PG15: P2.37  [project net OV_VSYNC]

### Notes on the sheet
- TFCard SDIO D0
- TFCard SDIO D1
- TFCard SDIO D3
- USB D-
- KEY
- USB D+
- TFCard SDIO D2
- TFCard SDIO CLK
- TFCard SDIO CMD
- EEPROM I2C SCL
- EEPROM I2C SDA
- FLASH SPI_MOSI
- LED
- FLASH SPI_MISO
- FLASH SPI_CS
- FLASH SPI_CLK
- IO引出

## Nets that join several sheets
3V3: Nestling_2.1_EXB (7 pins), Nestling_2.1_EXB_POWER (C8.1 C11.1 R6.2 U4.2), Nestling_2.1_EXB_Interface (10 pins), Nestling_2.1_EXB_MPU6050 (C20.2 C22.1 IC4.8 IC4.13), Nestling_2.1_EXB_OLED (9 pins), Nestling_2.1_EXB_WIFI_ESP8266EX (WIFI_CON_JP6.1 WIFI_PWR_JP5.1), Nestling_2.1_EXB_IO (P3.3 P3.4)
5V: Nestling_2.1_EXB (Nestling_2.1.59 Nestling_2.1.60), Nestling_2.1_EXB_POWER (5 pins), Nestling_2.1_EXB_Interface (2.4'/2.8'LCD.28 C16.2 MODULE_VCC_JP3.3), Nestling_2.1_EXB_IO (P3.1 P3.2)
5V_USB: Nestling_2.1_EXB_POWER (Q1.3), Nestling_2.1_EXB_Interface (8 pins)
GND: Nestling_2.1_EXB (11 pins), Nestling_2.1_EXB_POWER (20 pins), Nestling_2.1_EXB_Interface (27 pins), Nestling_2.1_EXB_MPU6050 (8 pins), Nestling_2.1_EXB_OLED (20 pins), Nestling_2.1_EXB_WIFI_ESP8266EX (16 pins), Nestling_2.1_EXB_IO (P2.1 P2.2 P2.3 P2.4)
FSMC_A0: Nestling_2.1_EXB (Nestling_2.1.53 U1.5), Nestling_2.1_EXB_IO (P2.53)
FSMC_A1: Nestling_2.1_EXB (Nestling_2.1.54 U1.4), Nestling_2.1_EXB_IO (P2.54)
FSMC_A2: Nestling_2.1_EXB (Nestling_2.1.55 U1.3), Nestling_2.1_EXB_IO (P2.55)
FSMC_A3: Nestling_2.1_EXB (Nestling_2.1.56 U1.2), Nestling_2.1_EXB_IO (P2.56)
FSMC_A4: Nestling_2.1_EXB (Nestling_2.1.57 U1.1), Nestling_2.1_EXB_IO (P2.57)
FSMC_A5: Nestling_2.1_EXB (Nestling_2.1.58 U1.44), Nestling_2.1_EXB_IO (P2.58)
FSMC_A6: Nestling_2.1_EXB (Nestling_2.1.93 U1.43), Nestling_2.1_EXB_IO (P3.35)
FSMC_A7: Nestling_2.1_EXB (Nestling_2.1.92 U1.42), Nestling_2.1_EXB_IO (P3.34)
FSMC_A8: Nestling_2.1_EXB (Nestling_2.1.91 U1.27), Nestling_2.1_EXB_IO (P3.33)
FSMC_A9: Nestling_2.1_EXB (Nestling_2.1.90 U1.26), Nestling_2.1_EXB_IO (P3.32)
FSMC_A10: Nestling_2.1_EXB (Nestling_2.1.89 U1.25), Nestling_2.1_EXB_Interface (2.4'/2.8'LCD.2), Nestling_2.1_EXB_IO (P3.31)
FSMC_A11: Nestling_2.1_EXB (Nestling_2.1.88 U1.24), Nestling_2.1_EXB_IO (P3.30)
FSMC_A12: Nestling_2.1_EXB (Nestling_2.1.64 U1.22), Nestling_2.1_EXB_IO (P3.6)
FSMC_A13: Nestling_2.1_EXB (Nestling_2.1.63 U1.21), Nestling_2.1_EXB_IO (P3.5)
FSMC_A14: Nestling_2.1_EXB (Nestling_2.1.5 U1.20), Nestling_2.1_EXB_IO (P2.5)
FSMC_A15: Nestling_2.1_EXB (Nestling_2.1.6 U1.19), Nestling_2.1_EXB_IO (P2.6)
FSMC_A16: Nestling_2.1_EXB (Nestling_2.1.69 U1.18), Nestling_2.1_EXB_IO (P3.11)
FSMC_A17: Nestling_2.1_EXB (Nestling_2.1.68 U1.23), Nestling_2.1_EXB_IO (P3.10)
FSMC_A18: Nestling_2.1_EXB (Nestling_2.1.67 U1.28), Nestling_2.1_EXB_IO (P3.9)
FSMC_D0: Nestling_2.1_EXB (Nestling_2.1.66 U1.7), Nestling_2.1_EXB_Interface (2.4'/2.8'LCD.6), Nestling_2.1_EXB_IO (P3.8)
FSMC_D1: Nestling_2.1_EXB (Nestling_2.1.65 U1.8), Nestling_2.1_EXB_Interface (2.4'/2.8'LCD.7), Nestling_2.1_EXB_IO (P3.7)
FSMC_D2: Nestling_2.1_EXB (Nestling_2.1.23 U1.9), Nestling_2.1_EXB_Interface (2.4'/2.8'LCD.8), Nestling_2.1_EXB_IO (P2.23)
FSMC_D3: Nestling_2.1_EXB (Nestling_2.1.24 U1.10), Nestling_2.1_EXB_Interface (2.4'/2.8'LCD.9), Nestling_2.1_EXB_IO (P2.24)
FSMC_D4: Nestling_2.1_EXB (Nestling_2.1.87 U1.13), Nestling_2.1_EXB_Interface (2.4'/2.8'LCD.10), Nestling_2.1_EXB_IO (P3.29)
FSMC_D5: Nestling_2.1_EXB (Nestling_2.1.86 U1.14), Nestling_2.1_EXB_Interface (2.4'/2.8'LCD.11), Nestling_2.1_EXB_IO (P3.28)
FSMC_D6: Nestling_2.1_EXB (Nestling_2.1.85 U1.15), Nestling_2.1_EXB_Interface (2.4'/2.8'LCD.12), Nestling_2.1_EXB_IO (P3.27)
FSMC_D7: Nestling_2.1_EXB (Nestling_2.1.84 U1.16), Nestling_2.1_EXB_Interface (2.4'/2.8'LCD.13), Nestling_2.1_EXB_IO (P3.26)
FSMC_D8: Nestling_2.1_EXB (Nestling_2.1.83 U1.29), Nestling_2.1_EXB_Interface (2.4'/2.8'LCD.14), Nestling_2.1_EXB_IO (P3.25)
FSMC_D9: Nestling_2.1_EXB (Nestling_2.1.82 U1.30), Nestling_2.1_EXB_Interface (2.4'/2.8'LCD.15), Nestling_2.1_EXB_IO (P3.24)
FSMC_D10: Nestling_2.1_EXB (Nestling_2.1.81 U1.31), Nestling_2.1_EXB_Interface (2.4'/2.8'LCD.16), Nestling_2.1_EXB_IO (P3.23)
FSMC_D11: Nestling_2.1_EXB (Nestling_2.1.80 U1.32), Nestling_2.1_EXB_Interface (2.4'/2.8'LCD.17), Nestling_2.1_EXB_IO (P3.22)
FSMC_D12: Nestling_2.1_EXB (Nestling_2.1.79 U1.35), Nestling_2.1_EXB_Interface (2.4'/2.8'LCD.18), Nestling_2.1_EXB_IO (P3.21)
FSMC_D13: Nestling_2.1_EXB (Nestling_2.1.72 U1.36), Nestling_2.1_EXB_Interface (2.4'/2.8'LCD.19), Nestling_2.1_EXB_IO (P3.14)
FSMC_D14: Nestling_2.1_EXB (Nestling_2.1.71 U1.37), Nestling_2.1_EXB_Interface (2.4'/2.8'LCD.20), Nestling_2.1_EXB_IO (P3.13)
FSMC_D15: Nestling_2.1_EXB (Nestling_2.1.70 U1.38), Nestling_2.1_EXB_Interface (2.4'/2.8'LCD.21), Nestling_2.1_EXB_IO (P3.12)
FSMC_NBL0: Nestling_2.1_EXB (Nestling_2.1.45 U1.39), Nestling_2.1_EXB_IO (P2.45)
FSMC_NBL1: Nestling_2.1_EXB (Nestling_2.1.46 U1.40), Nestling_2.1_EXB_IO (P2.46)
FSMC_NE3: Nestling_2.1_EXB (Nestling_2.1.32 R10.1 U1.6), Nestling_2.1_EXB_IO (P2.32)
FSMC_NE4: Nestling_2.1_EXB (Nestling_2.1.34), Nestling_2.1_EXB_Interface (2.4'/2.8'LCD.1), Nestling_2.1_EXB_IO (P2.34)
FSMC_NOE: Nestling_2.1_EXB (Nestling_2.1.27 U1.41), Nestling_2.1_EXB_Interface (2.4'/2.8'LCD.4), Nestling_2.1_EXB_IO (P2.27)
FSMC_NWE: Nestling_2.1_EXB (Nestling_2.1.28 U1.17), Nestling_2.1_EXB_Interface (2.4'/2.8'LCD.3), Nestling_2.1_EXB_IO (P2.28)
LCD_BL: Nestling_2.1_EXB (Nestling_2.1.97), Nestling_2.1_EXB_Interface (2.4'/2.8'LCD.23), Nestling_2.1_EXB_IO (P3.39)
LCD_RST: Nestling_2.1_EXB (Nestling_2.1.19), Nestling_2.1_EXB_Interface (2.4'/2.8'LCD.5), Nestling_2.1_EXB_IO (P2.19)
MODULE_EN: Nestling_2.1_EXB (Nestling_2.1.40), Nestling_2.1_EXB_Interface (MODULE_JP2.6), Nestling_2.1_EXB_IO (P2.40)
MODULE_RXD: Nestling_2.1_EXB (Nestling_2.1.105), Nestling_2.1_EXB_Interface (MODULE_JP2.2), Nestling_2.1_EXB_IO (P3.47)
MODULE_STATE: Nestling_2.1_EXB (Nestling_2.1.38), Nestling_2.1_EXB_Interface (MODULE_JP2.1), Nestling_2.1_EXB_IO (P2.38)
MODULE_TXD: Nestling_2.1_EXB (Nestling_2.1.104), Nestling_2.1_EXB_Interface (MODULE_JP2.3), Nestling_2.1_EXB_IO (P3.46)
MPU6050_INT: Nestling_2.1_EXB (Nestling_2.1.115), Nestling_2.1_EXB_MPU6050 (R13.1), Nestling_2.1_EXB_IO (P3.57)
MPU6050_SCL: Nestling_2.1_EXB (Nestling_2.1.41), Nestling_2.1_EXB_MPU6050 (R11.1), Nestling_2.1_EXB_IO (P2.41)
MPU6050_SDA: Nestling_2.1_EXB (Nestling_2.1.42), Nestling_2.1_EXB_MPU6050 (R12.1), Nestling_2.1_EXB_IO (P2.42)
OLED_CS: Nestling_2.1_EXB (Nestling_2.1.76), Nestling_2.1_EXB_OLED (OLED_JP4.7 U2.13), Nestling_2.1_EXB_IO (P3.18)
OLED_DC: Nestling_2.1_EXB (Nestling_2.1.74), Nestling_2.1_EXB_OLED (OLED_JP4.6 U2.15), Nestling_2.1_EXB_IO (P3.16)
OLED_RES: Nestling_2.1_EXB (Nestling_2.1.106), Nestling_2.1_EXB_OLED (OLED_JP4.5 U2.14), Nestling_2.1_EXB_IO (P3.48)
OLED_SCL: Nestling_2.1_EXB (Nestling_2.1.75), Nestling_2.1_EXB_OLED (OLED_JP4.3 R16.1 U2.18), Nestling_2.1_EXB_IO (P3.17)
OLED_SDA: Nestling_2.1_EXB (Nestling_2.1.73), Nestling_2.1_EXB_OLED (OLED_JP4.4 R15.1 R17.1 U2.19), Nestling_2.1_EXB_IO (P3.15)
OV_D0: Nestling_2.1_EXB (Nestling_2.1.111), Nestling_2.1_EXB_Interface (JP1.16), Nestling_2.1_EXB_IO (P3.53)
OV_D1: Nestling_2.1_EXB (Nestling_2.1.110), Nestling_2.1_EXB_Interface (JP1.15), Nestling_2.1_EXB_IO (P3.52)
OV_D2: Nestling_2.1_EXB (Nestling_2.1.109), Nestling_2.1_EXB_Interface (JP1.14), Nestling_2.1_EXB_IO (P3.51)
OV_D3: Nestling_2.1_EXB (Nestling_2.1.108), Nestling_2.1_EXB_Interface (JP1.13), Nestling_2.1_EXB_IO (P3.50)
OV_D4: Nestling_2.1_EXB (Nestling_2.1.99), Nestling_2.1_EXB_Interface (JP1.12), Nestling_2.1_EXB_IO (P3.41)
OV_D5: Nestling_2.1_EXB (Nestling_2.1.98), Nestling_2.1_EXB_Interface (JP1.11), Nestling_2.1_EXB_IO (P3.40)
OV_D6: Nestling_2.1_EXB (Nestling_2.1.10), Nestling_2.1_EXB_Interface (JP1.10), Nestling_2.1_EXB_IO (P2.10)
OV_D7: Nestling_2.1_EXB (Nestling_2.1.11), Nestling_2.1_EXB_Interface (JP1.9), Nestling_2.1_EXB_IO (P2.11)
OV_HREF: Nestling_2.1_EXB (Nestling_2.1.35), Nestling_2.1_EXB_Interface (JP1.6), Nestling_2.1_EXB_IO (P2.35)
OV_PCLK: Nestling_2.1_EXB (Nestling_2.1.8), Nestling_2.1_EXB_Interface (JP1.7), Nestling_2.1_EXB_IO (P2.8)
OV_PWDN: Nestling_2.1_EXB (Nestling_2.1.30), Nestling_2.1_EXB_Interface (JP1.18), Nestling_2.1_EXB_IO (P2.30)
OV_RESET: Nestling_2.1_EXB (Nestling_2.1.36), Nestling_2.1_EXB_Interface (JP1.17), Nestling_2.1_EXB_IO (P2.36)
OV_SCL: Nestling_2.1_EXB (Nestling_2.1.26), Nestling_2.1_EXB_Interface (JP1.3), Nestling_2.1_EXB_IO (P2.26)
OV_SDA: Nestling_2.1_EXB (Nestling_2.1.29), Nestling_2.1_EXB_Interface (JP1.4), Nestling_2.1_EXB_IO (P2.29)
OV_VSYNC: Nestling_2.1_EXB (Nestling_2.1.37), Nestling_2.1_EXB_Interface (JP1.5), Nestling_2.1_EXB_IO (P2.37)
OV_XCLK: Nestling_2.1_EXB (Nestling_2.1.14), Nestling_2.1_EXB_Interface (JP1.8), Nestling_2.1_EXB_IO (P2.14)
PA0: Nestling_2.1_EXB (Nestling_2.1.107), Nestling_2.1_EXB_IO (P3.49)
PA4: Nestling_2.1_EXB (Nestling_2.1.103), Nestling_2.1_EXB_IO (P3.45)
PA5: Nestling_2.1_EXB (Nestling_2.1.102), Nestling_2.1_EXB_IO (P3.44)
PA6: Nestling_2.1_EXB (Nestling_2.1.101), Nestling_2.1_EXB_IO (P3.43)
PA7: Nestling_2.1_EXB (Nestling_2.1.100), Nestling_2.1_EXB_IO (P3.42)
PA9: Nestling_2.1_EXB (Nestling_2.1.15), Nestling_2.1_EXB_Interface (IC1.7), Nestling_2.1_EXB_IO (P2.15)
PA10: Nestling_2.1_EXB (Nestling_2.1.16), Nestling_2.1_EXB_Interface (IC1.6), Nestling_2.1_EXB_IO (P2.16)
PA11: Nestling_2.1_EXB (Nestling_2.1.17), Nestling_2.1_EXB_Interface (USB-Slave.A7 USB-Slave.B7), Nestling_2.1_EXB_IO (P2.17)
PA12: Nestling_2.1_EXB (Nestling_2.1.18), Nestling_2.1_EXB_Interface (R9.2 USB-Slave.A6 USB-Slave.B6), Nestling_2.1_EXB_IO (P2.18)
PB1: Nestling_2.1_EXB (Nestling_2.1.96), Nestling_2.1_EXB_Interface (2.4'/2.8'LCD.34), Nestling_2.1_EXB_IO (P3.38)
PB2: Nestling_2.1_EXB (Nestling_2.1.95), Nestling_2.1_EXB_Interface (2.4'/2.8'LCD.29), Nestling_2.1_EXB_IO (P3.37)
PB4: Nestling_2.1_EXB (Nestling_2.1.39), Nestling_2.1_EXB_IO (P2.39)
PB8: Nestling_2.1_EXB (Nestling_2.1.43), Nestling_2.1_EXB_IO (P2.43)
PB9: Nestling_2.1_EXB (Nestling_2.1.44), Nestling_2.1_EXB_IO (P2.44)
PB10: Nestling_2.1_EXB (Nestling_2.1.78), Nestling_2.1_EXB_WIFI_ESP8266EX (WIFI_UART_JP.4), Nestling_2.1_EXB_IO (P3.20)
PB11: Nestling_2.1_EXB (Nestling_2.1.77), Nestling_2.1_EXB_WIFI_ESP8266EX (WIFI_UART_JP.2), Nestling_2.1_EXB_IO (P3.19)
PC8: Nestling_2.1_EXB (Nestling_2.1.12), Nestling_2.1_EXB_IO (P2.12)
PC9: Nestling_2.1_EXB (Nestling_2.1.13), Nestling_2.1_EXB_IO (P2.13)
PC10: Nestling_2.1_EXB (Nestling_2.1.20), Nestling_2.1_EXB_IO (P2.20)
PC11: Nestling_2.1_EXB (Nestling_2.1.21), Nestling_2.1_EXB_IO (P2.21)
PC12: Nestling_2.1_EXB (Nestling_2.1.22), Nestling_2.1_EXB_IO (P2.22)
PC13: Nestling_2.1_EXB (Nestling_2.1.52), Nestling_2.1_EXB_IO (P2.52)
PD2: Nestling_2.1_EXB (Nestling_2.1.25), Nestling_2.1_EXB_IO (P2.25)
PE2: Nestling_2.1_EXB (Nestling_2.1.47), Nestling_2.1_EXB_IO (P2.47)
PE3: Nestling_2.1_EXB (Nestling_2.1.48), Nestling_2.1_EXB_IO (P2.48)
PE4: Nestling_2.1_EXB (Nestling_2.1.49), Nestling_2.1_EXB_IO (P2.49)
PE5: Nestling_2.1_EXB (Nestling_2.1.50), Nestling_2.1_EXB_IO (P2.50)
PE6: Nestling_2.1_EXB (IC6.1 Nestling_2.1.51), Nestling_2.1_EXB_IO (P2.51)
PF6: Nestling_2.1_EXB (Nestling_2.1.116), Nestling_2.1_EXB_WIFI_ESP8266EX (R26.2), Nestling_2.1_EXB_IO (P3.58)
PF8: Nestling_2.1_EXB (Nestling_2.1.114), Nestling_2.1_EXB_WIFI_ESP8266EX (R27.2), Nestling_2.1_EXB_IO (P3.56)
PF9: Nestling_2.1_EXB (Nestling_2.1.113), Nestling_2.1_EXB_Interface (2.4'/2.8'LCD.30), Nestling_2.1_EXB_IO (P3.55)
PF10: Nestling_2.1_EXB (Nestling_2.1.112), Nestling_2.1_EXB_Interface (2.4'/2.8'LCD.31), Nestling_2.1_EXB_IO (P3.54)
PF11: Nestling_2.1_EXB (Nestling_2.1.94), Nestling_2.1_EXB_Interface (2.4'/2.8'LCD.33), Nestling_2.1_EXB_IO (P3.36)
PG6: Nestling_2.1_EXB (Nestling_2.1.7), Nestling_2.1_EXB_IO (P2.7)
PG8: Nestling_2.1_EXB (Nestling_2.1.9), Nestling_2.1_EXB_IO (P2.9)
PG9: Nestling_2.1_EXB (Nestling_2.1.31), Nestling_2.1_EXB_IO (P2.31)
PG11: Nestling_2.1_EXB (Nestling_2.1.33), Nestling_2.1_EXB_IO (P2.33)